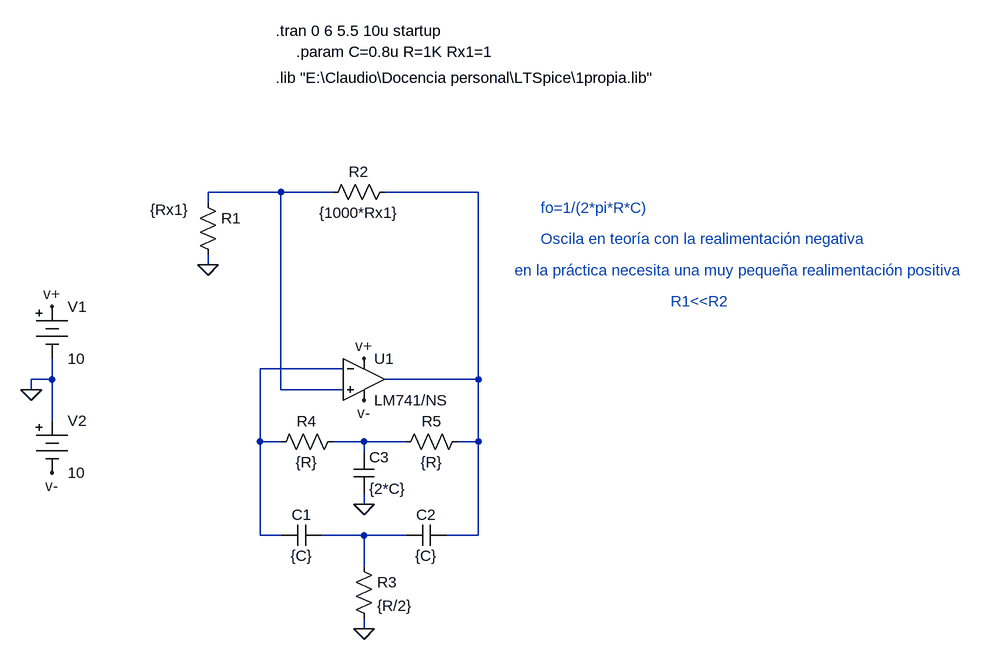
[diagram p0: schematic osc_2t.asc]
osc_2t.asc, the LTspice schematic file:
Version 4
SHEET 1 3972 680
WIRE 240 -128 128 -128
WIRE 320 -128 240 -128
WIRE 544 -128 400 -128
WIRE 128 -112 128 -128
WIRE 128 -16 128 -32
WIRE 336 144 208 144
WIRE -112 160 -112 128
WIRE -112 160 -144 160
WIRE 544 160 544 -128
WIRE 544 160 400 160
WIRE -144 176 -144 160
WIRE 240 176 240 -128
WIRE 336 176 240 176
WIRE -112 224 -112 160
WIRE 208 256 208 144
WIRE 240 256 208 256
WIRE 368 256 320 256
WIRE 432 256 368 256
WIRE 544 256 544 160
WIRE 544 256 512 256
WIRE 368 272 368 256
WIRE 368 352 368 336
WIRE 208 400 208 256
WIRE 240 400 208 400
WIRE 368 400 304 400
WIRE 432 400 368 400
WIRE 544 400 544 256
WIRE 544 400 496 400
WIRE 368 448 368 400
WIRE 368 544 368 528
FLAG -144 176 0
FLAG -112 48 v+
FLAG -112 304 v-
FLAG 128 -16 0
FLAG 368 544 0
FLAG 368 128 v+
FLAG 368 192 v-
FLAG 368 352 0
SYMBOL Misc\\battery -112 32 R0
WINDOW 123 0 0 Left 0
WINDOW 39 0 0 Left 0
SYMATTR InstName V1
SYMATTR Value 10
SYMBOL Misc\\battery -112 208 R0
WINDOW 123 0 0 Left 0
WINDOW 39 0 0 Left 0
SYMATTR InstName V2
SYMATTR Value 10
SYMBOL res 112 -128 R0
WINDOW 3 -73 27 Left 2
SYMATTR Value {Rx1}
SYMATTR InstName R1
SYMBOL res 352 432 R0
SYMATTR InstName R3
SYMATTR Value {R/2}
SYMBOL cap 304 384 R90
WINDOW 0 0 32 VBottom 2
WINDOW 3 32 32 VTop 2
SYMATTR InstName C1
SYMATTR Value {C}
SYMBOL cap 496 384 R90
WINDOW 0 0 32 VBottom 2
WINDOW 3 32 32 VTop 2
SYMATTR InstName C2
SYMATTR Value {C}
SYMBOL OpAmps\\opamp2 368 96 R0
SYMATTR InstName U1
SYMATTR Value LM741/NS
SYMBOL res 336 240 R90
WINDOW 0 0 56 VBottom 2
WINDOW 3 32 56 VTop 2
SYMATTR InstName R4
SYMATTR Value {R}
SYMBOL res 528 240 R90
WINDOW 0 0 56 VBottom 2
WINDOW 3 32 56 VTop 2
SYMATTR InstName R5
SYMATTR Value {R}
SYMBOL cap 352 272 R0
SYMATTR InstName C3
SYMATTR Value {2*C}
SYMBOL res 416 -144 R90
WINDOW 0 0 56 VBottom 2
WINDOW 3 32 56 VTop 2
SYMATTR InstName R2
SYMATTR Value {1000*Rx1}
TEXT 264 -344 Left 2 !.param C=0.8u R=1K Rx1=1
TEXT 232 -376 Left 2 !.tran 0 6 5.5 10u startup
TEXT 232 -304 Left 2 !.lib "E:\\Claudio\\Docencia personal\\LTSpice\\1propia.lib"
TEXT 640 -104 Left 2 ;fo=1/(2*pi*R*C)
TEXT 640 -56 Left 2 ;Oscila en teoría con la realimentación negativa
TEXT 600 -8 Left 2 ;en la práctica necesita una muy pequeña realimentación positiva
TEXT 840 40 Left 2 ;R1<<R2

The netlist it stands for:
* osc_2t.asc
V1 v+ 0 10
V2 0 v- 10
R1 N001 0 {Rx1}
R3 N005 0 {R/2}
C1 N005 N003 {C}
C2 N002 N005 {C}
XU1 N001 N003 v+ v- N002 LM741/NS  ; pins In+ In- V+ V- OUT
R4 N004 N003 {R}
R5 N002 N004 {R}
C3 N004 0 {2*C}
R2 N002 N001 {1000*Rx1}
.param C=0.8u R=1K Rx1=1
.tran 0 6 5.5 10u startup
.lib "E:\Claudio\Docencia personal\LTSpice\1propia.lib"
* fo=1/(2*pi*R*C)
* Oscila en teoría con la realimentación negativa
* en la práctica necesita una muy pequeña realimentación positiva
* R1<<R2
.backanno
.end